# EAGLE schematic FPGA_PPU (EAGLE 9.6.2)
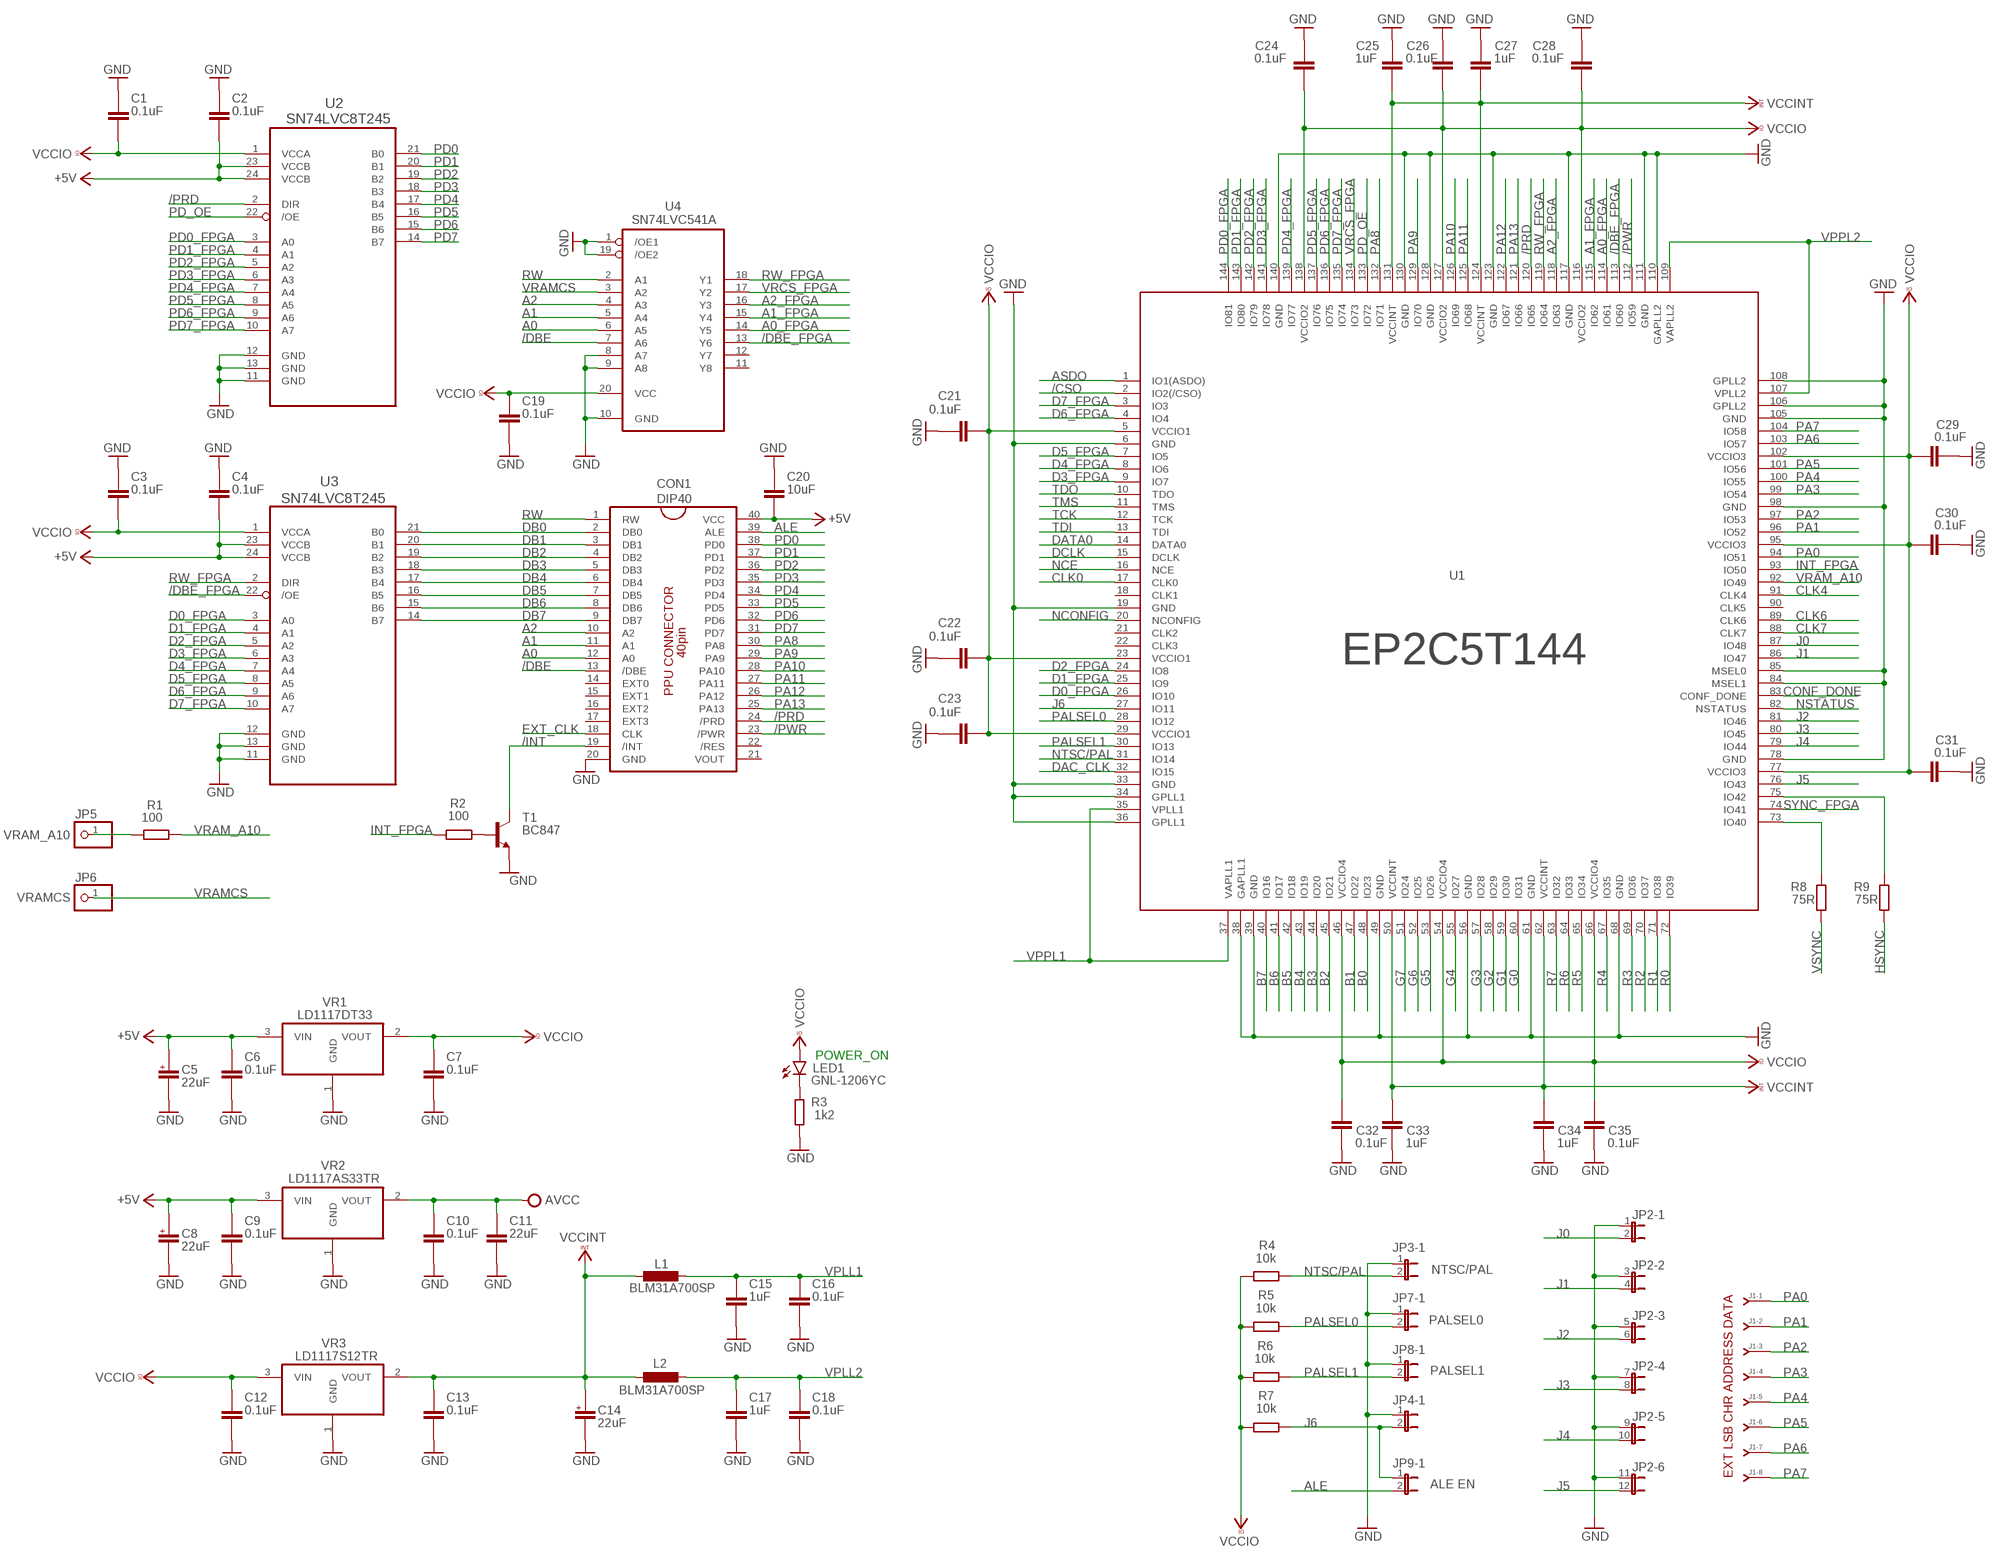
[diagram p0: schematic, sheet 1, part 1 of 2]
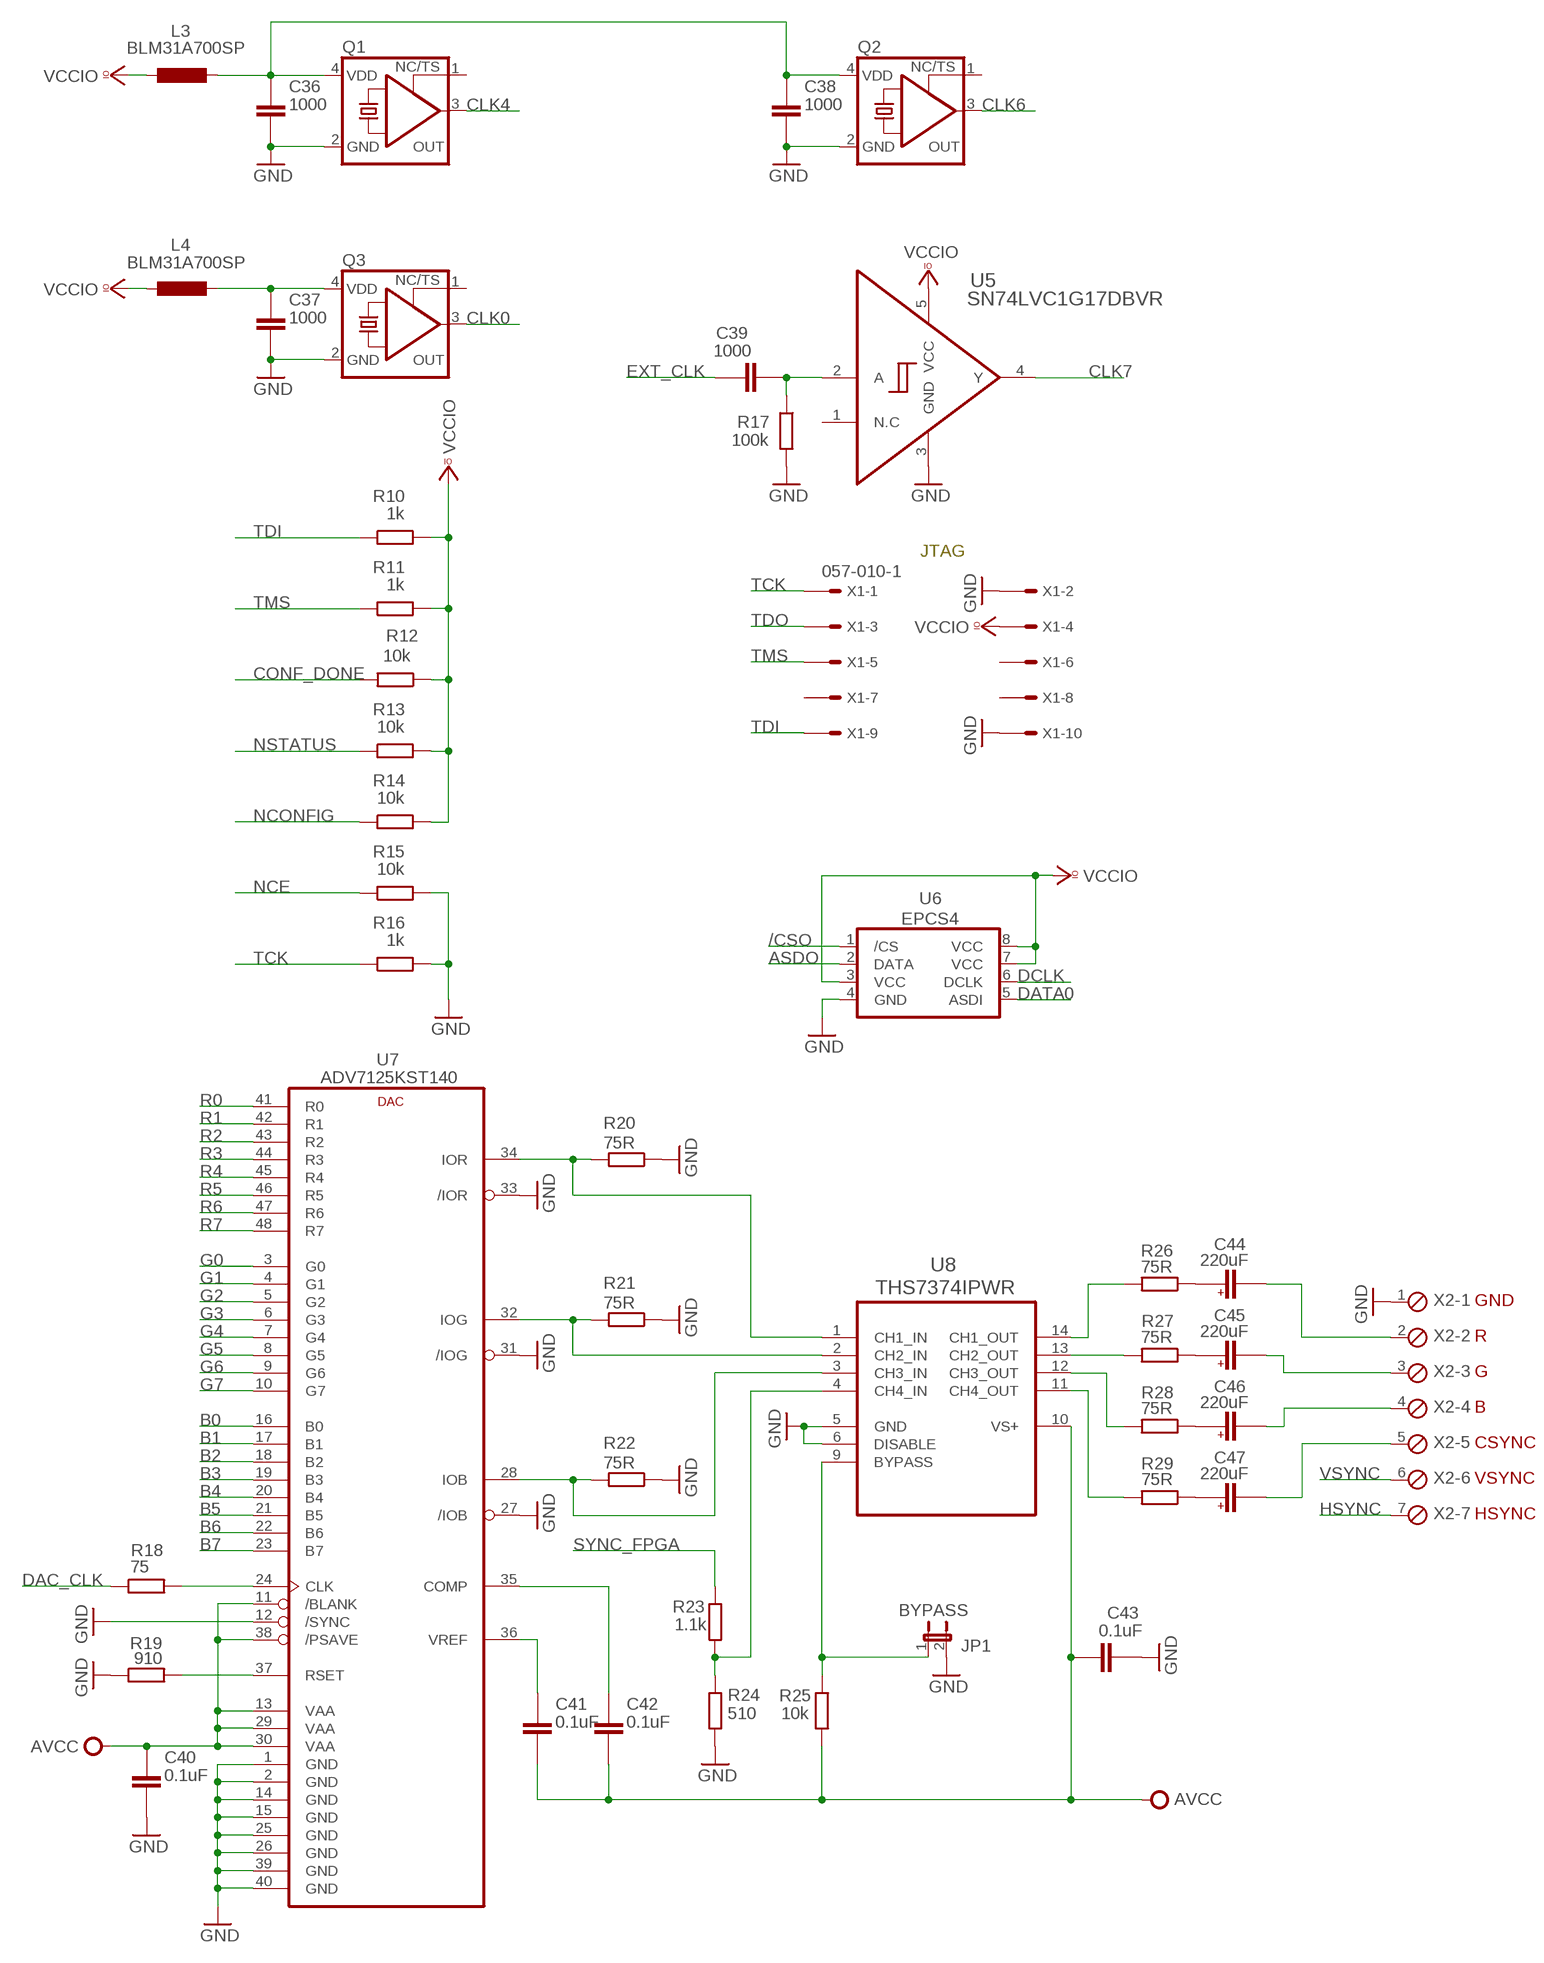
[diagram p1: schematic, sheet 1, part 2 of 2]

## Parts
C1  0.1uF  C-EUC0805  [C0805]
C2  0.1uF  C-EUC0805  [C0805]
C3  0.1uF  C-EUC0805  [C0805]
C4  0.1uF  C-EUC0805  [C0805]
C5  22uF  CPOL-EU153CLV-0505  [153CLV-0505]
C6  0.1uF  C-EUC0805  [C0805]
C7  0.1uF  C-EUC0805  [C0805]
C8  22uF  CPOL-EU153CLV-0505  [153CLV-0505]
C9  0.1uF  C-EUC0805  [C0805]
C10  0.1uF  C-EUC0805  [C0805]
C11  22uF  C-EUC0805  [C0805]
C12  0.1uF  C-EUC0805  [C0805]
C13  0.1uF  C-EUC0805  [C0805]
C14  22uF  CPOL-EU153CLV-0505  [153CLV-0505]
C15  1uF  C-EUC0805  [C0805]
C16  0.1uF  C-EUC0805  [C0805]
C17  1uF  C-EUC0805  [C0805]
C18  0.1uF  C-EUC0805  [C0805]
C19  0.1uF  C-EUC0805  [C0805]
C20  10uF  C-EUC0805  [C0805]
C21  0.1uF  C-EUC0805  [C0805]
C22  0.1uF  C-EUC0805  [C0805]
C23  0.1uF  C-EUC0805  [C0805]
C24  0.1uF  C-EUC0805  [C0805]
C25  1uF  C-EUC0805  [C0805]
C26  0.1uF  C-EUC0805  [C0805]
C27  1uF  C-EUC0805  [C0805]
C28  0.1uF  C-EUC0805  [C0805]
C29  0.1uF  C-EUC0805  [C0805]
C30  0.1uF  C-EUC0805  [C0805]
C31  0.1uF  C-EUC0805  [C0805]
C32  0.1uF  C-EUC0805  [C0805]
C33  1uF  C-EUC0805  [C0805]
C34  1uF  C-EUC0805  [C0805]
C35  0.1uF  C-EUC0805  [C0805]
C36  1000  C-EUC0805  [C0805]
C37  1000  C-EUC0805  [C0805]
C38  1000  C-EUC0805  [C0805]
C39  1000  C-EUC0805  [C0805]
C40  0.1uF  C-EUC0805  [C0805]
C41  0.1uF  C-EUC0805  [C0805]
C42  0.1uF  C-EUC0805  [C0805]
C43  0.1uF  C-EUC0805  [C0805]
C44  220uF  CPOL-EU153CLV-0505  [153CLV-0505]
C45  220uF  CPOL-EU153CLV-0505  [153CLV-0505]
C46  220uF  CPOL-EU153CLV-0505  [153CLV-0505]
C47  220uF  CPOL-EU153CLV-0505  [153CLV-0505]
CON1  DIP40  [DIP-40]
J1  J-08-SIP-100  [SIP-100-08]
JP1  BYPASS  JP1E  [JP1]
JP2  JP6QE  [JP6Q]
JP3  NTSC/PAL  JP4QE  [JP4Q]
JP4  JP4QE  [JP4Q]
JP5  VRAM_A10  PINHD-1X1  [1X01]
JP6  VRAMCS  PINHD-1X1  [1X01]
JP7  PALSEL0  JP4QE  [JP4Q]
JP8  PALSEL1  JP4QE  [JP4Q]
JP9  ALE EN  JP4QE  [JP4Q]
L1  BLM31A700SP  L-EUL2012C  [L2012C]
L2  BLM31A700SP  L-EUL2012C  [L2012C]
L3  BLM31A700SP  L-EUL2012C  [L2012C]
L4  BLM31A700SP  L-EUL2012C  [L2012C]
LED1  GNL-1206YC  LED  [SMARTLED-TTW]
Q1  KXO-PXO/XO-V97  [7.0X5.08_KXO-(V)97]
Q2  KXO-PXO/XO-V95  [2.5X2.0_KXO-V95]
Q3  KXO-PXO/XO-V95  [2.5X2.0_KXO-V95]
R1  100  R-EU_R0805  [R0805]
R2  100  R-EU_R0805  [R0805]
R3  1k2  R-EU_R0805  [R0805]
R4  10k  R-EU_R0805  [R0805]
R5  10k  R-EU_R0805  [R0805]
R6  10k  R-EU_R0805  [R0805]
R7  10k  R-EU_R0805  [R0805]
R8  75R  R-EU_R0805  [R0805]
R9  75R  R-EU_R0805  [R0805]
R10  1k  R-EU_R0805  [R0805]
R11  1k  R-EU_R0805  [R0805]
R12  10k  R-EU_R0805  [R0805]
R13  10k  R-EU_R0805  [R0805]
R14  10k  R-EU_R0805  [R0805]
R15  10k  R-EU_R0805  [R0805]
R16  1k  R-EU_R0805  [R0805]
R17  100k  R-EU_R0805  [R0805]
R18  75  R-EU_R0805  [R0805]
R19  910  R-EU_R0805  [R0805]
R20  75R  R-EU_R0805  [R0805]
R21  75R  R-EU_R0805  [R0805]
R22  75R  R-EU_R0805  [R0805]
R23  1.1k  R-EU_R0805  [R0805]
R24  510  R-EU_R0805  [R0805]
R25  10k  R-EU_R0805  [R0805]
R26  75R  R-EU_R0805  [R0805]
R27  75R  R-EU_R0805  [R0805]
R28  75R  R-EU_R0805  [R0805]
R29  75R  R-EU_R0805  [R0805]
T1  BC847  [SOT23]
U1  EP2C5T144  [TQFP144]
U2  SN74LVC8T245  [SOP65P640X110-24N]
U3  SN74LVC8T245  [SOP65P640X110-24N]
U4  SN74LVC541A  [TSOP20]
U5  SN74LVC1G17DBVR  [SOT95P280X145-5N]
U6  EPCS4  [SO08]
U7  ADV7125KST140  [QFP50P900X900X160-48N]
U8  THS7374IPWR  [SOP65P640X120-14N]
VR1  LD1117DT33  [DPAK456P1010X240-3N]
VR2  LD1117AS33TR  [SOT230P700X180-4N]
VR3  LD1117S12TR  [SOT-223-3]
X1  057-010-1  [057-010-1]
X2  MPT7  [7POL254]

## Nets
+5V: C2.2 C4.2 C5.+ C6.1 C8.+ C9.1 C20.2 CON1.40(VCC) U2.23(VCCB) U2.24(VCCB) U3.23(VCCB) U3.24(VCCB) VR1.3(VIN) VR2.3(VIN)
/CSO: U1.2(IO2(/CSO)) U6.1(/CS)
/DBE: CON1.13(/DBE) U4.7(A6)
/DBE_FPGA: U1.113(IO60) U3.22(/OE) U4.13(Y6)
/INT: CON1.19(/INT) T1.3(C)
/PRD: CON1.24(/PRD) U1.120(IO65) U2.2(DIR)
/PWR: CON1.23(/PWR) U1.112(IO59)
A0: CON1.12(A0) U4.6(A5)
A0_FPGA: U1.114(IO61) U4.14(Y5)
A1: CON1.11(A1) U4.5(A4)
A1_FPGA: U1.115(IO62) U4.15(Y4)
A2: CON1.10(A2) U4.4(A3)
A2_FPGA: U1.118(IO63) U4.16(Y3)
ALE: CON1.39(ALE) JP9.2
ASDO: U1.1(IO1(ASDO)) U6.2(DATA)
AVCC: C10.1 C11.1 C40.1 C41.2 C42.2 C43.1 R25.2 U7.11(/BLANK) U7.13(VAA) U7.29(VAA) U7.30(VAA) U7.38(/PSAVE) U8.10(VS+) VR2.2(VOUT)
B0: U1.48(IO23) U7.16(B0)
B1: U1.47(IO22) U7.17(B1)
B2: U1.45(IO21) U7.18(B2)
B3: U1.44(IO20) U7.19(B3)
B4: U1.43(IO19) U7.20(B4)
B5: U1.42(IO18) U7.21(B5)
B6: U1.41(IO17) U7.22(B6)
B7: U1.40(IO16) U7.23(B7)
CLK0: Q3.3(OUT) U1.17(CLK0)
CLK4: Q1.3(OUT) U1.91(CLK4)
CLK6: Q2.3(OUT) U1.89(CLK6)
CLK7: U1.88(CLK7) U5.4(Y)
CONF_DONE: R12.2 U1.83(CONF_DONE)
D0_FPGA: U1.26(IO10) U3.3(A0)
D1_FPGA: U1.25(IO9) U3.4(A1)
D2_FPGA: U1.24(IO8) U3.5(A2)
D3_FPGA: U1.9(IO7) U3.6(A3)
D4_FPGA: U1.8(IO6) U3.7(A4)
D5_FPGA: U1.7(IO5) U3.8(A5)
D6_FPGA: U1.4(IO4) U3.9(A6)
D7_FPGA: U1.3(IO3) U3.10(A7)
DAC_CLK: R18.1 U1.32(IO15)
DATA0: U1.14(DATA0) U6.5(ASDI)
DB0: CON1.2(DB0) U3.21(B0)
DB1: CON1.3(DB1) U3.20(B1)
DB2: CON1.4(DB2) U3.19(B2)
DB3: CON1.5(DB3) U3.18(B3)
DB4: CON1.6(DB4) U3.17(B4)
DB5: CON1.7(DB5) U3.16(B5)
DB6: CON1.8(DB6) U3.15(B6)
DB7: CON1.9(DB7) U3.14(B7)
DCLK: U1.15(DCLK) U6.6(DCLK)
EXT_CLK: C39.1 CON1.18(CLK)
G0: U1.60(IO31) U7.3(G0)
G1: U1.59(IO30) U7.4(G1)
G2: U1.58(IO29) U7.5(G2)
G3: U1.57(IO28) U7.6(G3)
G4: U1.55(IO27) U7.7(G4)
G5: U1.53(IO26) U7.8(G5)
G6: U1.52(IO25) U7.9(G6)
G7: U1.51(IO24) U7.10(G7)
GND: C1.1 C2.1 C3.1 C4.1 C5.- C6.2 C7.2 C8.- C9.2 C10.2 C11.2 C12.2 C13.2 C14.- C15.2 C16.2 C17.2 C18.2 C19.2 C20.1 C21.1 C22.1 C23.1 C24.1 C25.1 C26.1 C27.1 C28.1 C29.2 C30.2 C31.2 C32.2 C33.2 C34.2 C35.2 C36.2 C37.2 C38.2 C40.2 C43.2 CON1.20(GND) JP1.2 JP2.1 JP2.3 JP2.5 JP2.7 JP2.9 JP2.11 JP3.1 JP4.1 JP7.1 JP8.1 Q1.2(GND) Q2.2(GND) Q3.2(GND) R3.2 R15.2 R16.2 R17.2 R19.1 R20.1 R21.1 R22.1 R24.2 T1.2(E) U1.6(GND) U1.19(GND) U1.33(GND) U1.34(GPLL1) U1.36(GPLL1) U1.38(GAPLL1) U1.39(GND) U1.49(GND) U1.56(GND) U1.61(GND) U1.68(GND) U1.78(GND) U1.84(MSEL1) U1.85(MSEL0) U1.98(GND) U1.105(GND) U1.106(GPLL2) U1.108(GPLL2) U1.110(GAPLL2) U1.111(GND) U1.117(GND) U1.123(GND) U1.128(GND) U1.130(GND) U1.140(GND) U2.11(GND) U2.12(GND) U2.13(GND) U3.11(GND) U3.12(GND) U3.13(GND) U4.1(/OE1) U4.8(A7) U4.9(A8) U4.10(GND) U4.19(/OE2) U5.3(GND) U6.4(GND) U7.1(GND) U7.2(GND) U7.12(/SYNC) U7.14(GND) U7.15(GND) U7.25(GND) U7.26(GND) U7.27(/IOB) U7.31(/IOG) U7.33(/IOR) U7.39(GND) U7.40(GND) U8.5(GND) U8.6(DISABLE) VR1.1(GND) VR2.1(GND) VR3.1(GND) X1.2 X1.10 X2.1
HSYNC: R9.2 X2.7
INT_FPGA: R2.2 U1.93(IO50)
J0: JP2.2 U1.87(IO48)
J1: JP2.4 U1.86(IO47)
J2: JP2.6 U1.81(IO46)
J3: JP2.8 U1.80(IO45)
J4: JP2.10 U1.79(IO44)
J5: JP2.12 U1.76(IO43)
J6: JP4.2 JP9.1 R7.2 U1.27(IO11)
N$1: C44.+ R26.1
N$2: R8.1 U1.73(IO40)
N$4: C44.- X2.2
N$5: R9.1 U1.75(IO42)
N$6: C36.1 C38.1 L3.2 Q1.4(VDD) Q2.4(VDD)
N$7: JP5.1 R1.1
N$8: C45.+ R27.1
N$11: C45.- X2.3
N$17: C46.- X2.4
N$18: R22.2 U7.28(IOB) U8.3(CH3_IN)
N$19: C47.- X2.5
N$23: R21.2 U7.32(IOG) U8.2(CH2_IN)
N$24: R2.1 T1.1(B)
N$25: C39.2 R17.1 U5.2(A)
N$26: LED1.C@1(C) R3.1
N$27: C37.1 L4.2 Q3.4(VDD)
N$28: C46.+ R28.1
N$29: C47.+ R29.1
N$30: C41.1 U7.36(VREF)
N$58: R19.2 U7.37(RSET)
N$59: R18.2 U7.24(CLK)
N$62: C42.1 U7.35(COMP)
N$65: R20.2 U7.34(IOR) U8.1(CH1_IN)
N$66: R23.2 R24.1 U8.4(CH4_IN)
N$67: JP1.1 R25.1 U8.9(BYPASS)
N$69: R29.2 U8.11(CH4_OUT)
N$70: R28.2 U8.12(CH3_OUT)
N$71: R27.2 U8.13(CH2_OUT)
N$72: R26.2 U8.14(CH1_OUT)
NCE: R15.1 U1.16(NCE)
NCONFIG: R14.1 U1.20(NCONFIG)
NSTATUS: R13.1 U1.82(NSTATUS)
NTSC/PAL: JP3.2 R4.2 U1.31(IO14)
PA0: J1.1 U1.94(IO51)
PA1: J1.2 U1.96(IO52)
PA2: J1.3 U1.97(IO53)
PA3: J1.4 U1.99(IO54)
PA4: J1.5 U1.100(IO55)
PA5: J1.6 U1.101(IO56)
PA6: J1.7 U1.103(IO57)
PA7: J1.8 U1.104(IO58)
PA8: CON1.30(PA8) U1.132(IO71)
PA9: CON1.29(PA9) U1.129(IO70)
PA10: CON1.28(PA10) U1.126(IO69)
PA11: CON1.27(PA11) U1.125(IO68)
PA12: CON1.26(PA12) U1.122(IO67)
PA13: CON1.25(PA13) U1.121(IO66)
PALSEL0: JP7.2 R5.2 U1.28(IO12)
PALSEL1: JP8.2 R6.2 U1.30(IO13)
PD0: CON1.38(PD0) U2.21(B0)
PD0_FPGA: U1.144(IO81) U2.3(A0)
PD1: CON1.37(PD1) U2.20(B1)
PD1_FPGA: U1.143(IO80) U2.4(A1)
PD2: CON1.36(PD2) U2.19(B2)
PD2_FPGA: U1.142(IO79) U2.5(A2)
PD3: CON1.35(PD3) U2.18(B3)
PD3_FPGA: U1.141(IO78) U2.6(A3)
PD4: CON1.34(PD4) U2.17(B4)
PD4_FPGA: U1.139(IO77) U2.7(A4)
PD5: CON1.33(PD5) U2.16(B5)
PD5_FPGA: U1.137(IO76) U2.8(A5)
PD6: CON1.32(PD6) U2.15(B6)
PD6_FPGA: U1.136(IO75) U2.9(A6)
PD7: CON1.31(PD7) U2.14(B7)
PD7_FPGA: U1.135(IO74) U2.10(A7)
PD_OE: U1.133(IO72) U2.22(/OE)
R0: U1.72(IO39) U7.41(R0)
R1: U1.71(IO38) U7.42(R1)
R2: U1.70(IO37) U7.43(R2)
R3: U1.69(IO36) U7.44(R3)
R4: U1.67(IO35) U7.45(R4)
R5: U1.65(IO34) U7.46(R5)
R6: U1.64(IO33) U7.47(R6)
R7: U1.63(IO32) U7.48(R7)
RW: CON1.1(RW) U4.2(A1)
RW_FPGA: U1.119(IO64) U3.2(DIR) U4.18(Y1)
SYNC_FPGA: R23.1 U1.74(IO41)
TCK: R16.1 U1.12(TCK) X1.1
TDI: R10.1 U1.13(TDI) X1.9
TDO: U1.10(TDO) X1.3
TMS: R11.1 U1.11(TMS) X1.5
VCCINT: C13.1 C14.+ C25.2 C27.2 C33.1 C34.1 L1.2 L2.1 U1.50(VCCINT) U1.62(VCCINT) U1.124(VCCINT) U1.131(VCCINT) VR3.2(VOUT)
VCCIO: C1.2 C3.2 C7.1 C12.1 C19.1 C21.2 C22.2 C23.2 C24.2 C26.2 C28.2 C29.1 C30.1 C31.1 C32.1 C35.1 L3.1 L4.1 LED1.A@1(A) R4.1 R5.1 R6.1 R7.1 R10.2 R11.2 R12.1 R13.2 R14.2 U1.5(VCCIO1) U1.23(VCCIO1) U1.29(VCCIO1) U1.46(VCCIO4) U1.54(VCCIO4) U1.66(VCCIO4) U1.77(VCCIO3) U1.95(VCCIO3) U1.102(VCCIO3) U1.116(VCCIO2) U1.127(VCCIO2) U1.138(VCCIO2) U2.1(VCCA) U3.1(VCCA) U4.20(VCC) U5.5(VCC) U6.3(VCC) U6.7(VCC) U6.8(VCC) VR1.2(VOUT) VR3.3(VIN) X1.4
VPLL1: C15.1 C16.1 L1.1
VPLL2: C17.1 C18.1 L2.2
VPPL1: U1.35(VPLL1) U1.37(VAPLL1)
VPPL2: U1.107(VPLL2) U1.109(VAPLL2)
VRAM_A10: R1.2 U1.92(IO49)
VRAMCS: JP6.1 U4.3(A2)
VRCS_FPGA: U1.134(IO73) U4.17(Y2)
VSYNC: R8.2 X2.6
Unconnected: CON1.14(EXT0) CON1.15(EXT1) CON1.16(EXT2) CON1.17(EXT3) CON1.21(VOUT) CON1.22(/RES) JP3.3 JP3.4 JP3.5 JP3.6 JP3.7 JP3.8 JP4.3 JP4.4 JP4.5 JP4.6 JP4.7 JP4.8 JP7.3 JP7.4 JP7.5 JP7.6 JP7.7 JP7.8 JP8.3 JP8.4 JP8.5 JP8.6 JP8.7 JP8.8 JP9.3 JP9.4 JP9.5 JP9.6 JP9.7 JP9.8 Q1.1(TS) Q2.1(TS) Q3.1(TS) U1.18(CLK1) U1.21(CLK2) U1.22(CLK3) U1.90(CLK5) U4.11(Y8) U4.12(Y7) U5.1(N.C) X1.6 X1.7 X1.8

## Notes on the sheet
- JTAG
- GND
- R
- G
- B
- POWER_ON
- CSYNC
- VSYNC
- HSYNC
- EXT LSB CHR ADDRESS DATA

## Library data of the parts
C1-C4 C6 C7 C9-C13 C15-C43 = rcl_my:C-EU: CAPACITOR, European symbol; SPICEPREFIX: C
C5 C8 C14 C44-C47 = rcl_my:CPOL-EU: POLARIZED CAPACITOR, European symbol; SPICEPREFIX: C
CON1 = SnapEDA-Library:DIP40
J1 = con-headers-jp:J-08-: HEADER JACK PINS
JP1 = jumper:JP1E: JUMPER
JP2 = jumper:JP6QE: JUMPER
JP3 JP4 JP7-JP9 = jumper:JP4QE: JUMPER
JP5 JP6 = pinhead:PINHD-1X1: PIN HEADER
L1-L4 = rcl:L-EU: INDUCTOR, European symbol; SPICEPREFIX: L
LED1 = led:LED: LED OSRAM: - CHIPLED LG R971, LG N971, LY N971, LG Q971, LY Q971, LO R971, LY R971 LH N974, LH R974 LS Q976, LO Q976, LY Q976 LO Q996 - Hyper CHIPLED LW Q18S LB Q993, LB Q99A, LB R99A - SideLED LS A670, LO A670, LY A670, LG A670, LP A670 LB A673, LV A673, LT A673, LW A673 LH A674 LY A675 LS A676, LA A676, LO A676, LY A676, LW A676 LS A679, LY A679, LG A679 - Hyper Micro SIDELED® LS Y876, LA Y876, LO Y876, LY Y876 LT Y87S - SmartLED LW L88C, LW L88S LB L89C, LB L89S, LG L890 LS L89K, LO L89K, LY L89K LS L896, LA L896, LO L896, LY L896 - TOPLED LS T670, LO T670, LY T670, LG T670, LP T670 LSG T670, LSP T670, LSY T670, LOP T670, LYG T670 LG T671, LOG T671, LSG T671 LB T673, LV T673, LT T673, LW T673 LH T674 LS T676, LA T676, LO T676, LY T676, LB T676, LH T676, LSB T676, LW T676 LB T67C, LV T67C, LT T67C, LS T67K, LO T67K, LY T67K, LW E67C LS E67B, LA E67B, LO E67B, LY E67B, LB E67C, LV E67C, LT E67C LW T67C LS T679, LY T679, LG T679 LS T770, LO T770, LY T770, LG T770, LP T770 LB T773, LV T773, LT T773, LW T773 LH T774 LS E675, LA E675, LY E675, LS T675 LS T776, LA T776, LO T776, LY T776, LB T776 LHGB T686 LT T68C, LB T68C - Hyper Mini TOPLED® LB M676 - Mini TOPLED Santana® LG M470 LS M47K, LO M47K, LY M47K Source: http://www.osram.convergy.de LUXEON: - LUMILED® LXK2-PW12-R00, LXK2-PW12-S00, LXK2-PW14-U00, LXK2-PW14-V00 LXK2-PM12-R00, LXK2-PM12-S00, LXK2-PM14-U00 LXK2-PE12-Q00, LXK2-PE12-R00, LXK2-PE12-S00, LXK2-PE14-T00, LXK2-PE14-U00 LXK2-PB12-K00, LXK2-PB12-L00, LXK2-PB12-M00, LXK2-PB14-N00, LXK2-PB14-P00, LXK2-PB14-Q00 LXK2-PR12-L00, LXK2-PR12-M00, LXK2-PR14-Q00, LXK2-PR14-R00 LXK2-PD12-Q00, LXK2-PD12-R00, LXK2-PD12-S00 LXK2-PH12-R00, LXK2-PH12-S00 LXK2-PL12-P00, LXK2-PL12-Q00, LXK2-PL12-R00 Source: www.luxeon.com KINGBRIGHT: KA-3528ASYC Source: www.kingbright.com
Q1-Q3 = crystal-geyer_V1_0:KXO-PXO/XO-V: Clock Oscillator (PXO/XO) MHz : KXO-V - Serie Model Size l/w/h [mm] Frequency Range Frequency Stability Temp. Range [°C] Output AECQ 200 availabel Datasheet KXO-V94 KXO-V94 KXO-V95 KXO-V95 KXO-V96 KXO-V96 KXO-V99 KXO-V99 KXO-97 KXO-V97 KXO-97 - KXO-V97 2.0/1.6/0.80 2.0/1.6/0.80 2.5/2.0/0.82 2.5/2.0/0.82 3.2/2.5/1.2 3.2/2.5/1.2 5.0/3.2/1.2 5.0/3.2/1.2 7.0/5.08/1.3 7.0/5.08/1.3 7.0/5.08/1.3 32,768 kHz 1,0 ~ 80,0 MHz 32,768 kHz 1,0 ~ 70,0 MHz 32,768 kHz 1,0 ~ 156,0 MHz 32,768 kHz 1,0 ~ 200,0 MHz 32,768 kHz 32,768 kHz 1,0 ~ 160,0 MHz ±25 … ±100ppm ±25 … ±100ppm ±25 … ±100ppm ±25 … ±100ppm ±25 … ±100ppm ±25 … ±100ppm ±25 … ±100ppm ±25 … ±100ppm ±25 … ±100ppm ±25 … ±100ppm ±25 … ±100ppm (*) -40°C …+85°C (*) -40°C …+85°C (*) -40°C …+85°C (*) -40°C …+85°C (*) -40°C …+85°C (*) -40°C …+85°C (*) -40°C …+85°C (*) -40°C …+85°C (*) -40°C …+85°C (*) -40°C …+85°C (*) -40°C …+85°C HCMOS HCMOS HCMOS HCMOS HCMOS HCMOS HCMOS HCMOS HCMOS HCMOS HCMOS - - yes yes yes yes - - - - - KXO-V94-kHz.pdf <http://www.geyer-electronic.de/uploads/tx_userartikelfrequenz/GEYER-KXO-V94-kHz.pdf> KXO-V94.pdf <http://www.geyer-electronic.de/uploads/tx_userartikelfrequenz/GEYER-KXO-V94.pdf> KXO-V95-kHz.pdf <http://www.geyer-electronic.de/uploads/tx_userartikelfrequenz/GEYER-KXO-V95-kHz.pdf> KXO-V95.pdf <http://www.geyer-electronic.de/uploads/tx_userartikelfrequenz/GEYER-KXO-V95.pdf> KXO-V96-kHz.pdf <http://www.geyer-electronic.de/uploads/tx_userartikelfrequenz/GEYER-KXO-V96-kHz.pdf> KXO-V96.pdf <http://www.geyer-electronic.de/uploads/tx_userartikelfrequenz/GEYER-KXO-V96.pdf> KXO-V99-kHz.pdf <http://www.geyer-electronic.de/uploads/tx_userartikelfrequenz/GEYER-KXO-V99-kHz.pdf> KXO-V99.pdf <http://www.geyer-electronic.de/uploads/tx_userartikelfrequenz/GEYER-KXO-V99.pdf> KXO-97-kHz.pdf <http://www.geyer-electronic.de/uploads/tx_userartikelfrequenz/GEYER-KXO-97-kHz.pdf> KXO-V97-kHz.pdf <http://www.geyer-electronic.de/uploads/tx_userartikelfrequenz/GEYER-KXO-V97-kHz.pdf> KXO-V97.pdf <http://www.geyer-electronic.de/uploads/tx_userartikelfrequenz/GEYER-KXO-V97.pdf> <http://www.geyer-electronic.de/fileadmin/template/img/logo-geyer-electronic.png> Details see: http://www.geyer-electronic.de/Frequenz-Produkte.9.0.html Created 2016-06-07, Hans Locher 2016 (C) Geyer Quartz Technology Hans Locher KXOV94,KXOV95;KXOV96;KXOV97;KXO97;2016;2520;3225;5032;70508;2,5x2,0;3,2x2,5;5,0x3,2;7,0x5,08;2.5x2.0;3.2x2.5;5.0x3.2;7.0x5.08;
R1-R29 = rcl:R-EU_: RESISTOR, European symbol; SPICEPREFIX: R
T1 = transistor:BC847: NPN TRANSISTOR
U1 = EP2C5T144:EP2C5T144: EP2C5T144 Auto generated by make-symbol-device-package-bsdl.ulp Rev. 19 Tip: Use split-device-symbol.ulp to generate a Device with multiple small symbols! Read HELP. Source: EP2C5T144.BSD; MPN: EP2C5T144C8N; OC_FARNELL: 1453495; OC_NEWARK: 51R0568
U2 U3 = SnapEDA-Library:SN74LVC8T245
U4 = SnapEDA-Library:SN74LVC541A; PACKAGE: TSSOP-20; SUPPLIER: TI
U5 = SN74LVC1G17DBVR:SN74LVC1G17DBVR
U6 = EPCS4:EPCS4
U7 = SnapEDA-Library:ADV7125KST140; A1_MIN: 0.15; A_MAX: 1.6; B_MAX: 0.27; B_MIN: 0.17; B_NOM: 0.22; D1_MAX: 7.2; D1_MIN: 6.8; D1_NOM: 7.0; D2_NOM: 0.0; D_MAX: 9.2; D_MIN: 8.8; D_NOM: 9.0; E1_MAX: 7.2; E1_MIN: 6.8; E1_NOM: 7.0; E2_NOM: 0.0; ENOM: 0.5; E_MAX: 9.2; E_MIN: 8.8; E_NOM: 9.0; L_MAX: 0.75; L_MIN: 0.45; L_NOM: 0.6; MANUFACTURER: Analog Devices; PIN_COUNT_D: 12.0; PIN_COUNT_E: 12.0; SNAPEDA_PACKAGE_ID: 105757; STANDARD: IPC 7351B
U8 = THS7374IPWR:THS7374IPWR
VR1 = LD1117DT33:LD1117DT33; MANUFACTURER: STMicroelectronics; PARTREV: 33; STANDARD: IPC7351B
VR2 = LD1117AS33TR:LD1117AS33TR
VR3 = LD1117S12TR:LD1117S12TR
X1 = con-panduit:057-010-: CONNECTOR 10-pin series 057 contact pc board low profile headers; OC_FARNELL: unknown; OC_NEWARK: unknown
X2 = con-phoenix-254:MPT7: PHOENIX CONNECTOR; OC_FARNELL: unknown; OC_NEWARK: unknown